# Altium project axleZ_dhs.PrjPcb
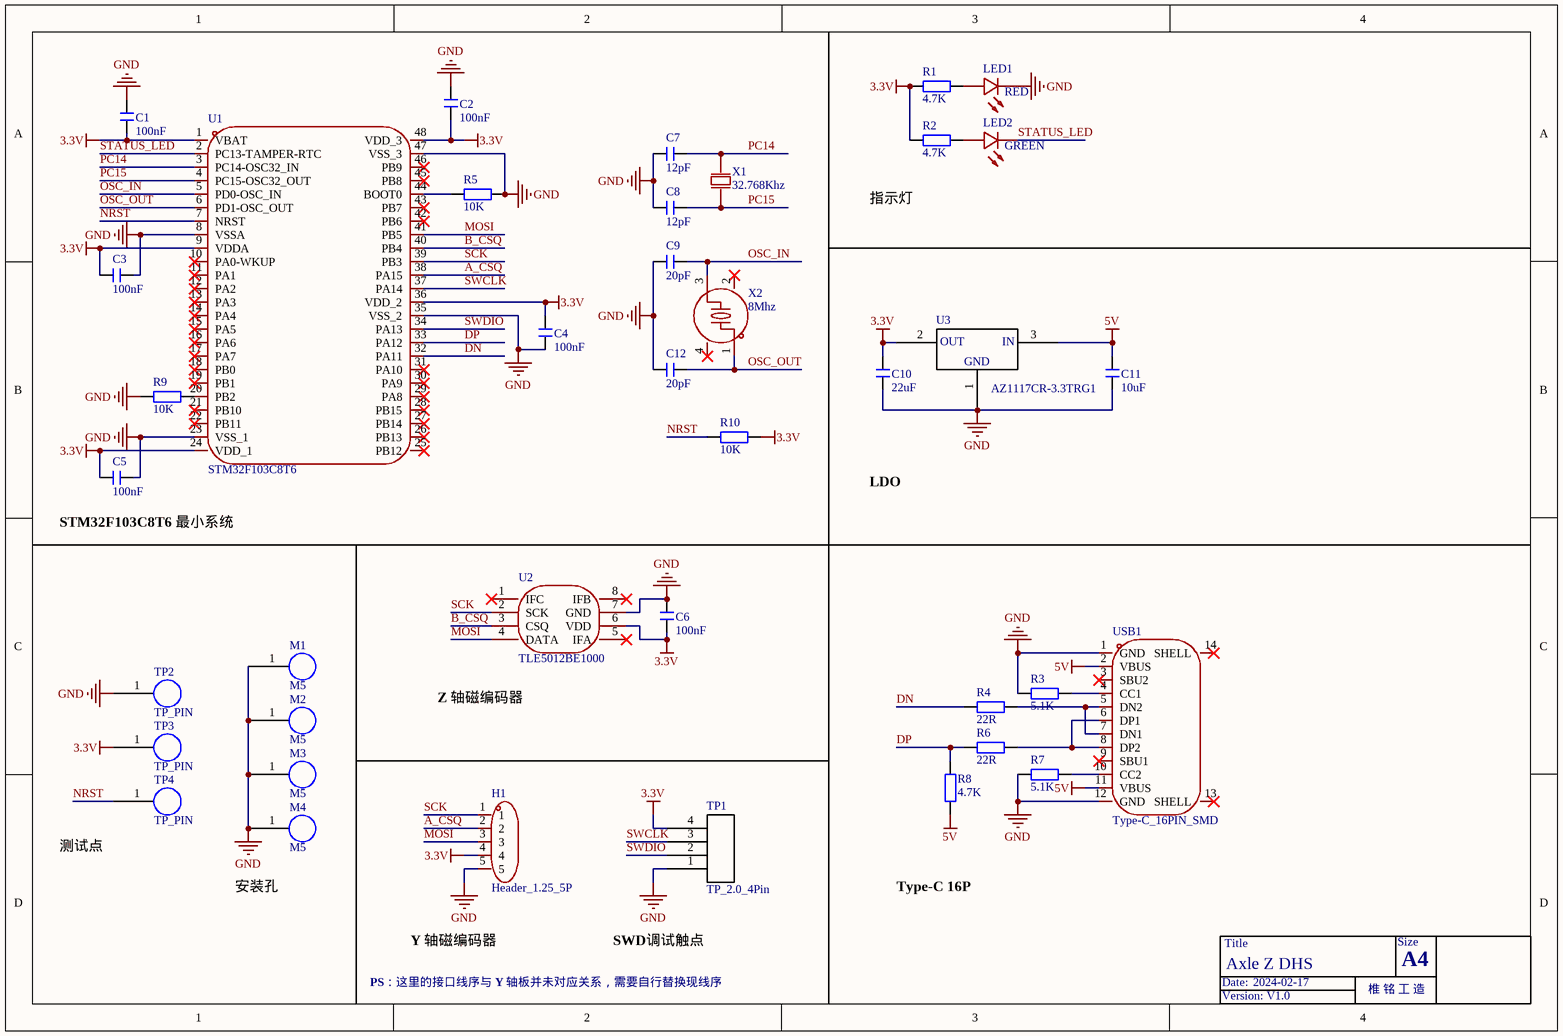
[diagram p0: Sheet.SchDoc]
1 sheet, 39 parts. Net scope: global (net labels, ports and power ports of the same name join across sheets).
Board file: PCB.PcbDoc

## Sheet Sheet.SchDoc: Axle Z DHS
size A4; Revision: V1.0; SheetNumber: 1; SheetTotal: 1; Time: 2024-02-17

### Parts
C1  100nF  [C_0603_l]
C2  100nF  [C_0603_l]
C3  100nF  [C_0603_l]
C4  100nF  [C_0603_l]
C5  100nF  [C_0603_l]
C6  100nF  [C_0603_l]
C7  12pF  [C_0603_l]
C8  12pF  [C_0603_l]
C9  20pF  [C_0603_l]
C10  22uF  [C_0603_l]
C11  10uF  [C_0603_l]
C12  20pF  [C_0603_l]
H1  Header_1.25_5P  [PH_1.25_5P]
LED1  RED  [LED_0603]
LED2  GREEN  [LED_0603]
M1  M5  [M5]
M2  M5  [M5]
M3  M5  [M5]
M4  M5  [M5]
R1  4.7K  [R_0603_L]
R2  4.7K  [R_0603_L]
R3  5.1K  [R_0603_L]
R4  22R  [R_0603_L]
R5  10K  [R_0603_L]
R6  22R  [R_0603_L]
R7  5.1K  [R_0603_L]
R8  4.7K  [R_0603_L]
R9  10K  [R_0603_L]
R10  10K  [R_0603_L]
TP1  TP_2.0_4Pin  [TP_2.0_4PIN_HOLE]
TP2  TP_PIN  [TP_PIN_1.2]
TP3  TP_PIN  [TP_PIN_1.2]
TP4  TP_PIN  [TP_PIN_1.2]
U1  STM32F103C8T6  [LQFP_48]
U2  TLE5012BE1000  [SO-8]
U3  AZ1117CR-3.3TRG1  [SOT_89_3]
USB1  Type-C_16PIN_SMD  [Type-C_16PIN_SMD]
X1  32.768Khz  [SMD_L3.2_W1.5_2P]
X2  8Mhz  [SMD_L3.2_W2.5_4P]

### Nets
3.3V: C1.1 C2.1 C3.2 C4.2 C5.2 C6.1 C10.2 H1.4 R1.1 R2.1 R10.2 TP1.4 TP3.1 U1.1(VBAT) U1.9(VDDA) U1.24(VDD_1) U1.36(VDD_2) U1.48(VDD_3) U2.6(VDD) U3.2
5V: C11.2 R8.1 U3.3 USB1.2(VBUS) USB1.11(VBUS)
GND: C1.2 C2.2 C3.1 C4.1 C5.1 C6.2 C7.2 C8.2 C9.2 C10.1 C11.1 C12.2 H1.5 LED1.1(K) M1.1 M2.1 M3.1 M4.1 R3.1 R5.2 R7.1 R9.2 TP1.1 TP2.1 U1.8(VSSA) U1.23(VSS_1) U1.35(VSS_2) U1.47(VSS_3) U2.7(GND) U3.1 USB1.1(GND) USB1.12(GND)
A_CSQ: H1.2 U1.38(PA15)
B_CSQ: U1.40(PB4) U2.3(CSQ)
DN: R4.1 U1.32(PA11)
DP: R6.1 R8.2 U1.33(PA12)
MOSI: H1.3 U1.41(PB5) U2.4(DATA)
NRST: R10.1 TP4.1 U1.7(NRST)
OSC_IN: C9.1 U1.5(PD0-OSC_IN) X2.3
OSC_OUT: C12.1 U1.6(PD1-OSC_OUT) X2.1
PC14: C7.1 U1.3(PC14-OSC32_IN) X1.2(OSC2)
PC15: C8.1 U1.4(PC15-OSC32_OUT) X1.1(OSC1)
SCK: H1.1 U1.39(PB3) U2.2(SCK)
STATUS_LED: LED2.1(K) U1.2(PC13-TAMPER-RTC)
SWCLK: TP1.3 U1.37(PA14)
SWDIO: TP1.2 U1.34(PA13)
NetLED1_2: LED1.2(A) R1.2
NetLED2_2: LED2.2(A) R2.2
NetR3_2: R3.2 USB1.4(CC1)
NetR4_2: R4.2 USB1.5(DN2) USB1.7(DN1)
NetR5_1: R5.1 U1.44(BOOT0)
NetR6_2: R6.2 USB1.6(DP1) USB1.8(DP2)
NetR7_2: R7.2 USB1.10(CC2)
NetR9_1: R9.1 U1.20(PB2)

Not connected (* = marked no-connect by the designer): U1 10(PA0-WKUP)* 11(PA1)* 12(PA2)* 13(PA3)* 14(PA4)* 15(PA5)* 16(PA6)* 17(PA7)* 18(PB0)* 19(PB1)* 21(PB10)* 22(PB11)* 25(PB12)* 26(PB13)* 27(PB14)* 28(PB15)* 29(PA8)* 30(PA9)* 31(PA10)* 42(PB6)* 43(PB7)* 45(PB8)* 46(PB9)*; U2 1(IFC)* 5(IFA)* 8(IFB)*; USB1 3(SBU2)* 9(SBU1)* 13(SHELL)* 14(SHELL)*; X2 2(GND)* 4(GND)*

### Notes on the sheet
- 指示灯
- LDO
- (near C5) STM32F103C8T6 最小系统
- Z 轴磁编码器
- 测试点
- 安装孔
- Type-C 16P
- PS：这里的接口线序与 Y 轴板并未对应关系，需要自行替换现线序
- Y 轴磁编码器
- SWD调试触点
- Date:
- Title
- Size
- 椎 铭 工 造
- A4
- Version:
- (in symbol AZ1117CR-3.3TRG1) OUT; IN; GND

### Library data of the parts
C1-C12 = C: MLCC 贴片独石电容; BOM_Name: 贴片 MCLL
H1 = Header_1.25_5P: 1.25mm 接插件; BOM_Name: 接插件
LED1 LED2 = SMD_LED: 贴片发光二极管; BOM_Name: LED
M1-M4 = M5: M5 螺丝安装孔
R1-R10 = R: 贴片电阻; BOM_Name: 贴片电阻
TP1 = TP_2.0_4Pin: 2.0mm 间距调试点
TP2-TP4 = TP_PIN: 单点测试点
U2 = TLE5012BE1000: 采用巨磁电阻的角度传感器; BOM_Name: 角度传感器
U3 = AZ1117CR-3.3TRG1: 3.3V 线性稳压器; BOM_Name: LDO
USB1 = Type-C_16PIN_SMD: 16Pin 卧贴 Type-C USB 连接器; BOM_Name: Type-C 连接器
X1 = 无源晶振-32.768K-2P: 32.768Khz 两脚 无源 贴片晶振; BOM_Name: 贴片晶振
X2 = 无源晶振-8Mhz-4P: 8Mhz 四脚 无源 贴片晶振; BOM_Name: 贴片晶振